# Altium schematic sheet POWER.SchDoc
size 594 x 420 mm; SheetNumber: 2; SheetTotal: 20
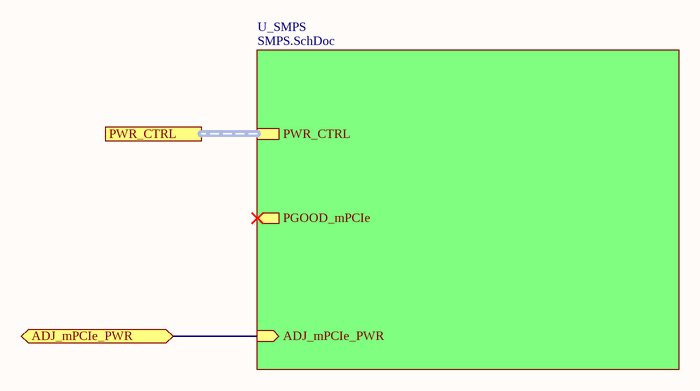
[diagram p0: POWER.SchDoc]

## Sub-sheets
U_SMPS = SMPS.SchDoc: PWR_CTRL (harness PWR_CTRL_SMP), PGOOD_mPCIe (out), ADJ_mPCIe_PWR (in)

## Ports
ADJ_mPCIe_PWR (bidir), PWR_CTRL (harness PWR_CTRL_SMP)

## Nets
ADJ_mPCIe_PWR: port ADJ_mPCIe_PWR, sheet U_SMPS/ADJ_mPCIe_PWR

## Buses and harness runs
harness port PWR_CTRL = sheet U_SMPS/PWR_CTRL

## Notes on the sheet
- DWG NO:
- REV:
- THIS DOCUMENT AND THE DATA DISCLOSED HEREIN OR
- HEREWITH IS THE PROPERTY OF ALTIUM LIMITED AND MAY
- BE FREELY DISTRIBUTED IN WHOLE. NO RIGHTS ARE
- RESERVED OR EXPRESS OR IMPLIED WARANTEE GIVEN.
- REVISION
- DESCRIPTION
- DATE
- APPROVED
- ENG:
- APPROVALS
- PROJECT
- DSN:
- CHK:
- REFERENCE DOCUMENTS
- PROJECT REVISION:
- TITLE
- DOCUMENT REVISION:
- DESIGN ITEM:
- BOM:
- FAB DWG:
- PCB DWG:
- ASSY DWG:
- SCALE:
- A2
- SIZE
- CAGE CODE
- FILE NAME
- DWG NO.
- SHEET
- OF
- REV